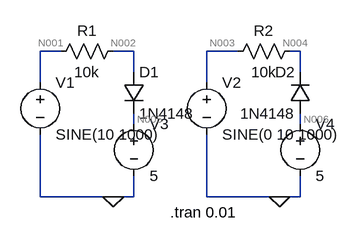
[diagram p0: schematic Draft8.asc]
Draft8.asc, the LTspice schematic file:
Version 4.1
SHEET 1 880 680
WIRE 16 32 -16 32
WIRE 128 32 96 32
WIRE 288 32 240 32
WIRE 384 32 368 32
WIRE 128 64 128 32
WIRE 384 64 384 32
WIRE -16 80 -16 32
WIRE 240 80 240 32
WIRE 128 144 128 128
WIRE 384 144 384 128
WIRE -16 256 -16 160
WIRE 96 256 -16 256
WIRE 128 256 128 224
WIRE 128 256 96 256
WIRE 240 256 240 160
WIRE 352 256 240 256
WIRE 384 256 384 224
WIRE 384 256 352 256
FLAG 96 256 0
FLAG 352 256 0
SYMBOL voltage -16 64 R0
WINDOW 123 0 0 Left 0
WINDOW 39 0 0 Left 0
SYMATTR InstName V1
SYMATTR Value SINE(10 1000)
SYMBOL voltage 240 64 R0
WINDOW 123 0 0 Left 0
WINDOW 39 0 0 Left 0
SYMATTR InstName V2
SYMATTR Value SINE(0 10 1000)
SYMBOL voltage 128 128 R0
WINDOW 123 0 0 Left 0
WINDOW 39 0 0 Left 0
SYMATTR InstName V3
SYMATTR Value 5
SYMBOL voltage 384 128 R0
WINDOW 123 0 0 Left 0
WINDOW 39 0 0 Left 0
SYMATTR InstName V4
SYMATTR Value 5
SYMBOL res 384 16 R90
WINDOW 0 0 56 VBottom 2
WINDOW 3 32 56 VTop 2
SYMATTR InstName R2
SYMATTR Value 10k
SYMBOL diode 112 64 R0
SYMATTR InstName D1
SYMATTR Value 1N4148
SYMBOL diode 400 128 R180
WINDOW 0 24 64 Left 2
WINDOW 3 24 0 Left 2
SYMATTR InstName D2
SYMATTR Value 1N4148
SYMBOL res 112 16 R90
WINDOW 0 0 56 VBottom 2
WINDOW 3 32 56 VTop 2
SYMATTR InstName R1
SYMATTR Value 10k
TEXT 184 280 Left 2 !.tran 0.01

The netlist it stands for:
* Draft8.asc
V1 N001 0 SINE(10 1000)
V2 N003 0 SINE(0 10 1000)
V3 N005 0 5
V4 N006 0 5
R2 N004 N003 10k
D1 N002 N005 1N4148
D2 N006 N004 1N4148
R1 N002 N001 10k
.model D D
.lib standard.dio
.tran 0.01
.backanno
.end

* Results of the author's LTspice run, read from the files saved beside the schematic
* Operating Point, zero values left out:
*   V(n001) = 10 V
*   V(n002) = 5.548 V
*   V(n004) = 4.452 V
*   V(n005) = 5 V
*   V(n006) = 5 V
*   I(D1) = 445.2 µA
*   I(D2) = 445.2 µA
*   I(R1) = -445.2 µA
*   I(R2) = 445.2 µA
*   I(V1) = -445.2 µA
*   I(V2) = 445.2 µA
*   I(V3) = 445.2 µA
*   I(V4) = -445.2 µA
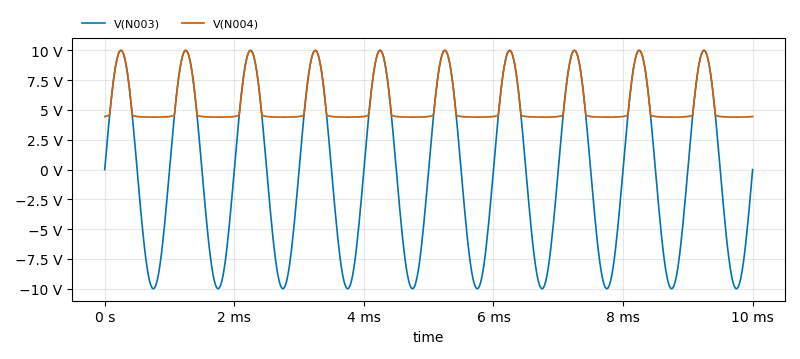
[diagram p1: Transient Analysis of Draft8.asc, plotted from the saved traces]
* Transient Analysis, 1 run:
*   V(N003): min -10 V, max 9.999 V, average 2.934 mV, rms 7.073 V, last 0 V
*   V(N004): min 4.398 V, max 9.999 V, average 5.718 V, rms 6.059 V, last 4.452 V